# Altium project button.PrjPCB
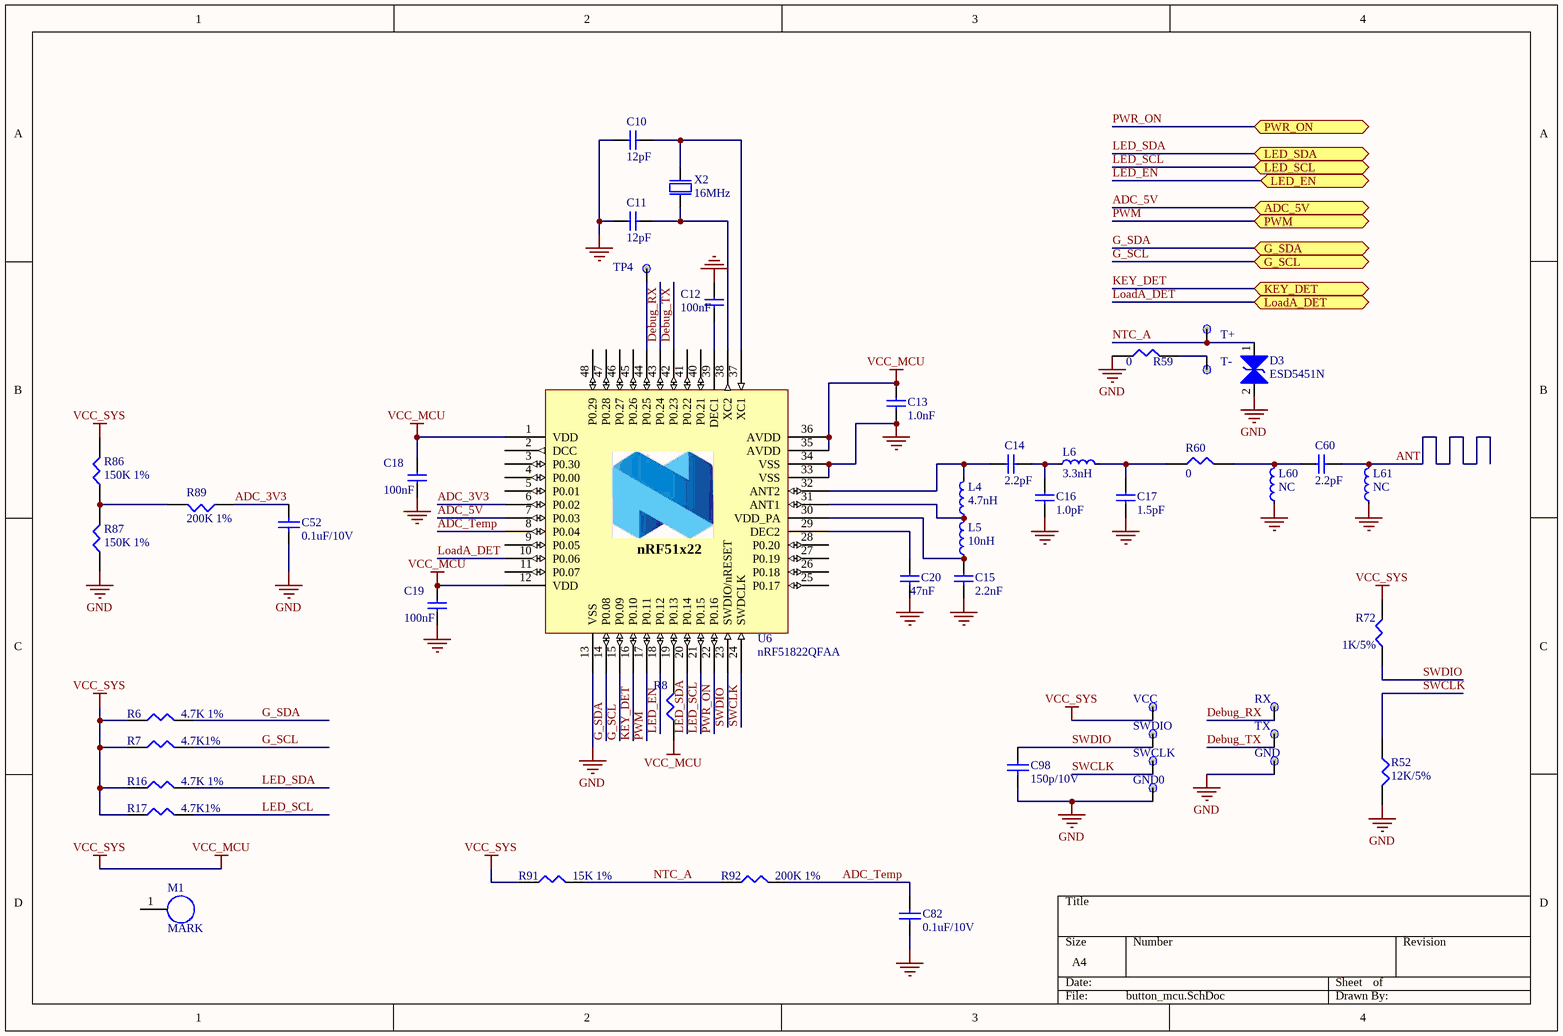
[diagram p0: button_mcu.SchDoc]
3 sheets, 92 parts. Net scope: flat (ports and power ports of the same name join across sheets).
Board files: button_TEST.PcbDoc, button_PVT_P5_201800706.PcbDoc
Sheets:
  button_mcu.SchDoc
  button_peripheral.SchDoc
  LED.SchDoc

## Sheet button_mcu.SchDoc
size A4

### Parts
C10  12pF  [CAPC1005X04L]
C11  12pF  [CAPC1005X04L]
C12  100nF  [CAPC1005X04L]
C13  1.0nF  [CAPC1005X04L]
C14  2.2pF  [CAPC1005X04L]
C15  2.2nF  [CAPC1005X04L]
C16  1.0pF  [CAPC1005X04L]
C17  1.5pF  [CAPC1005X04L]
C18  100nF  [CAPC1005X04L]
C19  100nF  [CAPC1005X04L]
C20  47nF  [CAPC1005X04L]
C52  0.1uF/10V  [0402C]
C60  2.2pF  [0402C]
C82  0.1uF/10V  [0402C]
C98  150p/10V  [0402C]
D3  ESD5451N  [DFN1006-2L]
GND  TP  [TESTPOINT2]  (value not drawn)
GND0  TP  [TESTPOINT2]  (value not drawn)
L4  4.7nH  [INDC1005X04L]
L5  10nH  [INDC1005X04L]
L6  3.3nH  [INDC1005X04L]
L60  NC  [0402R]
L61  NC  [0402R]
M1  MARK  [Mark Point]
R6  4.7K 1%  [0402R]
R7  4.7K1%  [0402R]
R8  1K 5%  [0402R]  (value not drawn)
R16  4.7K 1%  [0402R]
R17  4.7K1%  [0402R]
R52  12K/5%  [0402R]
R59  0  [0402R]
R60  0  [0402R]
R72  1K/5%  [0402R]
R86  150K 1%  [0402R]
R87  150K 1%  [0402R]
R89  200K 1%  [0402R]
R91  15K 1%  [0402R]
R92  200K 1%  [0402R]
RX  TP  [TESTPOINT2]  (value not drawn)
SWCLK  TP  [TESTPOINT2]  (value not drawn)
SWDIO  TP  [TESTPOINT2]  (value not drawn)
T+  TP  [TESTPOINT_PAD]  (value not drawn)
T-  TP  [TESTPOINT_PAD]  (value not drawn)
TP4  TP  [TESTPOINT2]  (value not drawn)
TX  TP  [TESTPOINT2]  (value not drawn)
U6  nRF51822QFAA  [QFN40P600X600X90-48N]
VCC  TP  [TESTPOINT2]  (value not drawn)
X2  16MHz  [XTAL/3225]

### Ports
ADC_5V, G_SCL, G_SDA, KEY_DET, LED_EN, LED_SCL, LED_SDA, LoadA_DET, PWM, PWR_ON

### Nets
GND: C10.2 C11.2 C12.1 C13.2 C15.2 C16.2 C17.2 C18.2 C19.2 C20.2 C52.1 C82.1 C98.1 D3.2 GND.1 GND0.1 L60.1 L61.1 R52.2 R59.1 R87.1 U6.13(VSS) U6.33(VSS) U6.34(VSS) U6.49 X2.2(GND) X2.4(GND)
VCC_MCU: C13.1 C18.1 C19.1 R6.1 R7.1 R8.1 R16.1 R17.1 R72.2 R86.2 R91.1 U6.1(VDD) U6.12(VDD) U6.35(AVDD) U6.36(AVDD) VCC.1  [also labelled VCC_SYS]
ADC_3V3: C52.2 R89.1 U6.6(P0.02)
ADC_5V: U6.7(P0.03) ; port ADC_5V
ADC_Temp: C82.2 R92.2 U6.8(P0.04)
ANT: C60.2 L61.2
Debug_RX: RX.1 U6.43(P0.24)
Debug_TX: TX.1 U6.42(P0.23)
G_SCL: R7.2 U6.15(P0.09) ; port G_SCL
G_SDA: R6.2 U6.14(P0.08) ; port G_SDA
KEY_DET: U6.16(P0.10) ; port KEY_DET
LED_EN: U6.18(P0.12) ; port LED_EN
LED_SCL: R17.2 U6.21(P0.15) ; port LED_SCL
LED_SDA: R16.2 U6.20(P0.14) ; port LED_SDA
LoadA_DET: U6.10(P0.06) ; port LoadA_DET
NTC_A: D3.1 R91.2 R92.1 T+.1
PWM: U6.17(P0.11) ; port PWM
PWR_ON: U6.22(P0.16) ; port PWR_ON
SWCLK: R52.1 SWCLK.1 U6.24(SWDCLK)
SWDIO: C98.2 R72.1 SWDIO.1 U6.23(SWDIO/nRESET)
NetC10_1: C10.1 U6.37(XC1) X2.1(inp)
NetC11_1: C11.1 U6.38(XC2) X2.3(out)
NetC12_2: C12.2 U6.39(DEC1)
NetC14_1: C14.1 L4.2 U6.32(ANT2)
NetC14_2: C14.2 C16.1 L6.1
NetC15_1: C15.1 L5.1 U6.30(VDD_PA)
NetC17_1: C17.1 L6.2 R60.1
NetC20_1: C20.1 U6.29(DEC2)
NetC60_1: C60.1 L60.2 R60.2
NetL4_1: L4.1 L5.2 U6.31(ANT1)
NetR8_2: R8.2 U6.19(P0.13)
NetR59_2: R59.2 T-.1
NetR86_1: R86.1 R87.2 R89.2
NetTP4_1: TP4.1 U6.44(P0.25)

Not connected (* = marked no-connect by the designer): M1 1; U6 2(DCC) 3(P0.30) 4(P0.00) 5(P0.01) 9(P0.05) 11(P0.07) 25(P0.17) 26(P0.18) 27(P0.19) 28(P0.20) 40(P0.21) 41(P0.22) 45(P0.26) 46(P0.27) 47(P0.28) 48(P0.29)

### Notes on the sheet
- (in symbol nRF51x22-QFAC) nRF51x22

### Library data of the parts
C10 C11 = C0402-12p: Capacitor, NP0, ±2%; Note: 50V; Artikkelnr Noca: 20029159; Artikkelnr Simpro: N.A.; Part Number: C0402-12p; Manufacturer: *; Manufacturer Part Number: *; Datasheet: *; LatestRevisionDate: 2011-05-11; Pin Count: 2; Publisher: Nordic Semiconductor; Published: 2009-05-08; Value: 12pF; Supplier: *; Supplier part number: *; 2nd source Supplier: *; 2nd source part number: *; Footprint Doc: 0402
C12 C18 C19 = C0402-100n: Capacitor, X7R, ±10%; Note: 16V; Artikkelnr Noca: 20039200; Artikkelnr Simpro: N.A.; Part Number: C0402-100n; Manufacturer: *; Manufacturer Part Number: *; Datasheet: *; LatestRevisionDate: 2009-11-23; Pin Count: 2; Publisher: Nordic Semiconductor; Published: 2009-05-08; Value: 100nF; Supplier: *; Supplier part number: *; 2nd source Supplier: *; 2nd source part number: *; Footprint Doc: 0402
C13 = C0402-1n0: Capacitor, X7R, ±10%; Note: 50V; Artikkelnr Noca: 20039223; Artikkelnr Simpro: N.A.; Part Number: C0402-1n0; Manufacturer: *; Manufacturer Part Number: *; Datasheet: *; LatestRevisionDate: 2009-11-23; Pin Count: 2; Publisher: Nordic Semiconductor; Published: 2009-05-08; Value: 1.0nF; Supplier: *; Supplier part number: *; 2nd source Supplier: *; 2nd source part number: *; Footprint Doc: 0402
C14 C60 = C0402-3.9p: Capacitor, NP0, ±0.1pF; Value: 3.9pF; Note: 50V; Artikkelnr Noca: N.A.; Part Number: C0402-3.9p; Manufacturer: *; Manufacturer Part Number: *; Datasheet: *; LatestRevisionDate: 2014-09-17; Pin Count: 2; Publisher: Nordic Semiconductor; Published: 2009-05-08; Supplier: *; Supplier part number: *; 2nd source Supplier: *; 2nd source part number: *; Footprint Doc: 0402; Artikkelnr Simpro: N.A.
C15 = C0402-2n2: Capacitor, X7R, ±10%; Note: 50V; Artikkelnr Noca: 20039221; Artikkelnr Simpro: N.A.; Part Number: C0402-2n2; Manufacturer: *; Manufacturer Part Number: *; Datasheet: *; LatestRevisionDate: 2009-11-23; Pin Count: 2; Publisher: Nordic Semiconductor; Published: 2009-05-08; Value: 2.2nF; Supplier: *; Supplier part number: *; 2nd source Supplier: *; 2nd source part number: *; Footprint Doc: 0402
C16 = C0402-1.0p: Capacitor, NP0, ±0.1pF; Note: 50V; Artikkelnr Noca: 20029140; Artikkelnr Simpro: N.A.; Part Number: C0402-1.0p; Manufacturer: *; Manufacturer Part Number: *; Datasheet: *; LatestRevisionDate: 2009-11-23; Pin Count: 2; Publisher: Nordic Semiconductor; Published: 2009-05-08; Value: 1.0pF; Supplier: *; Supplier part number: *; 2nd source Supplier: *; 2nd source part number: *; Footprint Doc: 0402
C17 = C0402-1.5p: Capacitor, NP0, ±0.1pF; Note: 50V; Artikkelnr Noca: 20029139; Artikkelnr Simpro: N.A.; Part Number: C0402-1.5p; Manufacturer: *; Manufacturer Part Number: *; Datasheet: *; LatestRevisionDate: 2009-11-23; Pin Count: 2; Publisher: Nordic Semiconductor; Published: 2009-05-08; Value: 1.5pF; Supplier: *; Supplier part number: *; 2nd source Supplier: *; 2nd source part number: *; Footprint Doc: 0402
C20 = C0402-47n: Capacitor, X7R, ±10%; Note: Chip Cap 10%; Artikkelnr Noca: 20039389; Artikkelnr Simpro: N.A.; Part Number: C0402-47n; Manufacturer: *; Manufacturer Part Number: *; Datasheet: *; LatestRevisionDate: 2009-05-08; Pin Count: 2; Publisher: Nordic Semiconductor; Published: 2009-05-08; Value: 47nF; Supplier: *; Supplier part number: *; 2nd source Supplier: *; 2nd source part number: *; Footprint Doc: 0402
C52 C82 C98 = CAP: Capacitor; Value: 100pF; Ordered by: Subcon; Published: 8-Jun-2000; Revision: July-2002: Re-released for DXP Platform.; Publisher: Altium Limited
D3 = ESD_1: 厂家：ROHM，型号：VMNZC6.8CST2RA
GND GND0 RX SWCLK SWDIO T+ T- TP4 TX VCC = TP: Ordered by: Subcon
L4 = L0402-4n7: High frequency chip inductor ±5%; Manufacturer: Murata; Manufacturer Part Number: LQP15MN4N7B02D; Artikkelnr Noca: 33029164; Artikkelnr Simpro: N.A.; Part Number: L0402-4n7; Datasheet: http://search.murata.co.jp/Ceramy/image/img/PDF/ENG/L0075S0084LQP15M.pdf; LatestRevisionDate: 2012-09-19; Pin Count: 2; Publisher: Nordic Semiconductor; Published: 2009-05-08; Value: 4.7nH; Note: High frequency chip inductor ±5%; Supplier: Digi-Key; Supplier part number: 490-1132-1-ND; 2nd source Supplier: *; 2nd source part number: *; Footprint Doc: 0402
L5 = L0402-27n: High frequency chip inductor ±5%; Manufacturer: Murata; Manufacturer Part Number: LQP15MN27NG02D; Value: 27nH; Note: High frequency chip inductor ±2%; Artikkelnr Noca: N.A.; Part Number: L0402-27n; Datasheet: http://search.murata.co.jp/Ceramy/image/img/PDF/ENG/L0075S0084LQP15M.pdf; LatestRevisionDate: 2014-09-17; Pin Count: 2; Publisher: Nordic Semiconductor; Published: 2014-06-12; Supplier: Digi-Key; Supplier part number: 490-6751-1-ND; 2nd source Supplier: *; 2nd source part number: *; Footprint Doc: 0402; Artikkelnr Simpro: N.A.
L6 = L0402-3n3: High frequency chip inductor ±5%; Manufacturer: Murata; Manufacturer Part Number: LQP15MN3N3B02D; Artikkelnr Noca: 33029369; Artikkelnr Simpro: N.A.; Part Number: L0402-3n3; Datasheet: http://search.murata.co.jp/Ceramy/image/img/PDF/ENG/L0075S0084LQP15M.pdf; LatestRevisionDate: 2012-09-19; Pin Count: 2; Publisher: Nordic Semiconductor; Published: 2009-05-08; Value: 3.3nH; Note: High frequency chip inductor ±5%; Supplier: Digi-Key; Supplier part number: 490-1130-1-ND; 2nd source Supplier: *; 2nd source part number: *; Footprint Doc: 0402
L60 L61 = L0402-4n7: High frequency chip inductor ±5%; Manufacturer: Murata; Manufacturer Part Number: LQP15MN4N7B02D; Value: 4.7nH; Artikkelnr Noca: 33029164; Artikkelnr Simpro: N.A.; Part Number: L0402-4n7; Datasheet: http://search.murata.co.jp/Ceramy/image/img/PDF/ENG/L0075S0084LQP15M.pdf; LatestRevisionDate: 2012-09-19; Pin Count: 2; Publisher: Nordic Semiconductor; Published: 2009-05-08; Note: High frequency chip inductor ±5%; Supplier: Digi-Key; Supplier part number: 490-1132-1-ND; 2nd source Supplier: *; 2nd source part number: *; Footprint Doc: 0402
M1 = PAD1: None
R6-R8 R16 R17 R52 R59 R60 R72 R86 R87 R89 R91 R92 = RES1: 厂家：Yageo，型号：RC0402FR-0720RL
U6 = nRF51x22-QFAC: Multi-protocol Bluetooth Low Energy, ANT and 2.4GHz proprietary system-on-chip; Manufacturer: Nordic Semiconductor; Note: nRF51422 - QFN48 6x6 0.4mm pitch; Artikkelnr Noca: N.A.; Part Number: nRF51x22-QFAC; Manufacturer Part Number: nRF51x22-QFAC; Datasheet: *; LatestRevisionDate: 2014-09-24; Pin Count: 48; Publisher: Nordic Semiconductor; Published: 2014-09-24; Value: nRF51x22-QFAC; Supplier: Nordic Semiconductor; Supplier part number: *; 2nd source Supplier: *; 2nd source part number: *; Footprint Doc: QFN-48; Artikkelnr Simpro: N.A.
X2 = NX2520SA-16MHZ-STD-CSW-5: XTAL SMD 2520, 16MHz, 8pF, ±40ppm; Manufacturer: NDK; Note: XTAL SMD 16.000MHz; Artikkelnr Noca: 22019192; Artikkelnr Simpro: N.A.; Part Number: NX2520SA-16MHZ-STD-CSW-5; Manufacturer Part Number: NX2520SA-16MHZ-STD-CSW-5; Datasheet: http://www.ndk.com/images/products/catalog/c_NX2520SA-STD-CSW-5_e.pdf; LatestRevisionDate: 2012-06-15; Pin Count: 4; Publisher: Nordic Semiconductor; Published: 2012-06-15; Value: 16MHz; Supplier: Digi-Key; Supplier part number: 644-1169-1-ND; 2nd source Supplier: *; 2nd source part number: *; Footprint Doc: BT-XTAL_2520

## Sheet button_peripheral.SchDoc
size A4
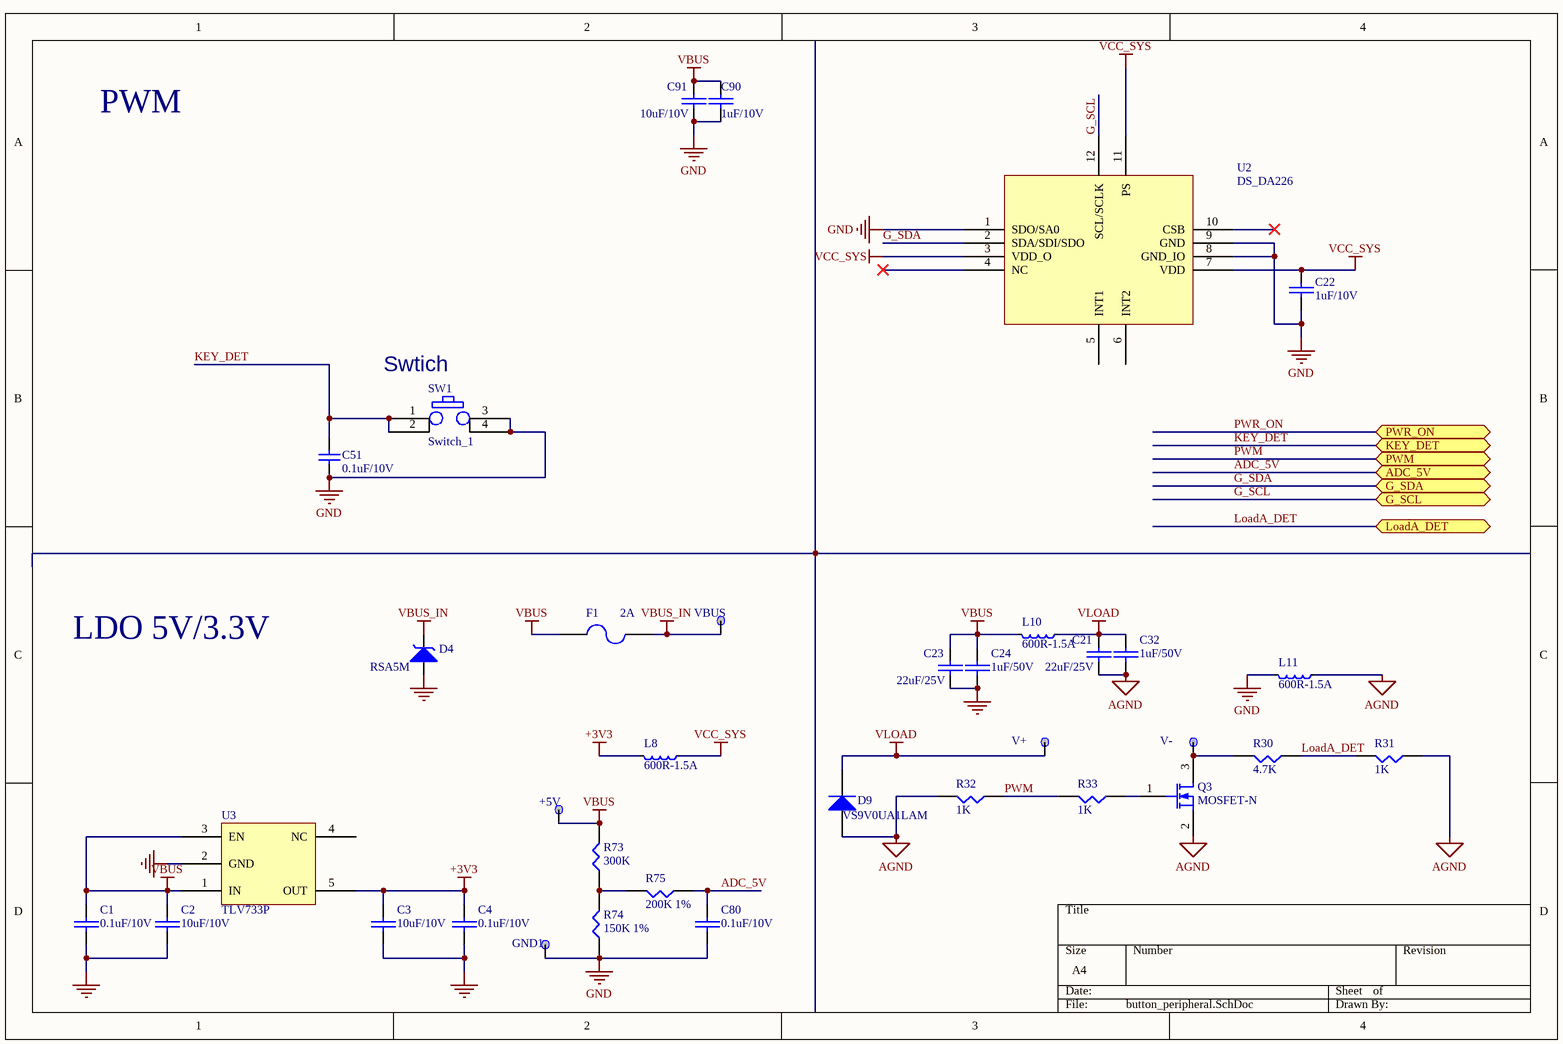
[diagram p1: button_peripheral.SchDoc]

### Parts
+5V  TP  [TESTPOINT2]  (value not drawn)
C1  0.1uF/10V  [0402C]
C2  10uF/10V  [0603C]
C3  10uF/10V  [0603C]
C4  0.1uF/10V  [0402C]
C21  22uF/25V  [0603C]
C22  1uF/10V  [0402C]
C23  22uF/25V  [0603C]
C24  1uF/50V  [0402C]
C32  1uF/50V  [0402C]
C51  0.1uF/10V  [0402C]
C80  0.1uF/10V  [0402C]
C90  1uF/10V  [0402C]
C91  10uF/10V  [TAN_0603]
D4  RSA5M  [SOD-123]
D9  VS9V0UA1LAM  [SOD_128]
F1  2A  [1206-FUSE - duplicate]
GND1  TP  [TESTPOINT_PAD]  (value not drawn)
L8  600R-1.5A  [L_0603]
L10  600R-1.5A  [L_0603]
L11  600R-1.5A  [L_0603]
Q3  MOSFET-N  [TSMT3]
R30  4.7K  [0402R]
R31  1K  [0402R]
R32  1K  [0402R]
R33  1K  [0402R]
R73  300K  [0402R]
R74  150K 1%  [0402R]
R75  200K 1%  [0402R]
SW1  Switch_1  [KEY_Panasonic]
U2  DS_DA226  [LGA-12]
U3  TLV733P  [SOT-23-5]
V+  TP  [TESTPOINT_PAD]  (value not drawn)
V-  TP  [TESTPOINT_PAD]  (value not drawn)
VBUS  TP  [TESTPOINT_PAD]  (value not drawn)

### Ports
ADC_5V, G_SCL, G_SDA, KEY_DET, LoadA_DET, PWM, PWR_ON

### Nets
+3V3: C3.1 C4.1 L8.2 U3.5(OUT)
AGND: C21.2 C32.2 D9.2(A) L11.1 Q3.2(S) R31.1 R32.2
GND: C1.2 C2.2 C3.2 C4.2 C22.2 C23.2 C24.2 C51.1 C80.2 C90.2 C91.2 D4.2(dIode2) GND1.1 L11.2 R74.1 SW1.3 SW1.4 U2.1(SDO/SA0) U2.8(GND_IO) U2.9(GND) U3.2(GND)
VBUS: +5V.1 C1.1 C2.1 C23.1 C24.1 C90.1 C91.1 F1.1 L10.2 R73.2 U3.1(IN) U3.3(EN)
VBUS_IN: D4.1(Diode1) F1.2 VBUS.1
VCC_SYS: C22.1 L8.1 U2.3(VDD_O) U2.7(VDD) U2.11(PS)  [project net VCC_MCU]
VLOAD: C21.1 C32.1 D9.1(K) L10.1 V+.1
ADC_5V: C80.1 R75.1 ; port ADC_5V
G_SCL: U2.12(SCL/SCLK) ; port G_SCL
G_SDA: U2.2(SDA/SDI/SDO) ; port G_SDA
KEY_DET: C51.2 SW1.1 SW1.2 ; port KEY_DET
LoadA_DET: R30.1 R31.2 ; port LoadA_DET
PWM: R32.1 R33.2 ; port PWM
NetQ3_1: Q3.1(G) R33.1
NetQ3_3: Q3.3(D) R30.2 V-.1
NetR73_1: R73.1 R74.2 R75.2

Not connected (* = marked no-connect by the designer): U2 4(NC)* 5(INT1) 6(INT2) 10(CSB)*; U3 4(NC)

### Notes on the sheet
- PWM
- (near SW1) Swtich
- LDO 5V/3.3V

### Library data of the parts
+5V GND1 V+ V- VBUS = TP: Ordered by: Subcon
C1 C4 C22 C24 C32 C80 = CAP: 厂家：Murata，型号：GRM155R71A104KA01D
C2 C3 C21 C23 C90 C91 = CAP: 厂家：Murata，型号：GRM188R61A106KE69D
C51 = CAP: as C52 on sheet button_mcu; Published: 8-Jun-2000; Revision: July-2002: Re-released for DXP Platform.; Publisher: Altium Limited
D4 = ESD_1: 厂家：ROHM，型号：VMNZC6.8CST2RA
D9 = Diode 1N4148: High Conductance Fast Diode
F1 = FUSE2: 厂家：万瑞和，型号：smd1206-200
L8 L10 L11 = L0402-27n: as L5 on sheet button_mcu; Part Number: L0402-27n; Datasheet: http://search.murata.co.jp/Ceramy/image/img/PDF/ENG/L0075S0084LQP15M.pdf; LatestRevisionDate: 2014-09-17; Pin Count: 2; Publisher: Nordic Semiconductor; Published: 2014-06-12; Supplier: Digi-Key; Supplier part number: 490-6751-1-ND; 2nd source Supplier: *; 2nd source part number: *; Footprint Doc: 0402; Artikkelnr Simpro: N.A.
Q3 = MOSFET: N-Channel MOSFET; Published: 8-Jun-2000; LatestRevisionDate: 17-Jul-2002; LatestRevisionNote: Re-released for DXP Platform.; PackageVersion: 1995/1996; PackageReference: E3; Publisher: Altium Limited; PackageDescription: TO, Flat Index; 3 In-Line, Axial Leads; Body Dia. 4.6mm; Lead Dia. 0.5 mm (max)
R30-R33 R73-R75 = RES1: 厂家：Yageo，型号：RC0402FR-0720RL
SW1 = Switch_1: 厂家：松下，型号：EVQPLMA15
U2 = LIS2DE12: 厂家：ST，型号：LIS2DH12
U3 = AP3410

## Sheet LED.SchDoc
size A4
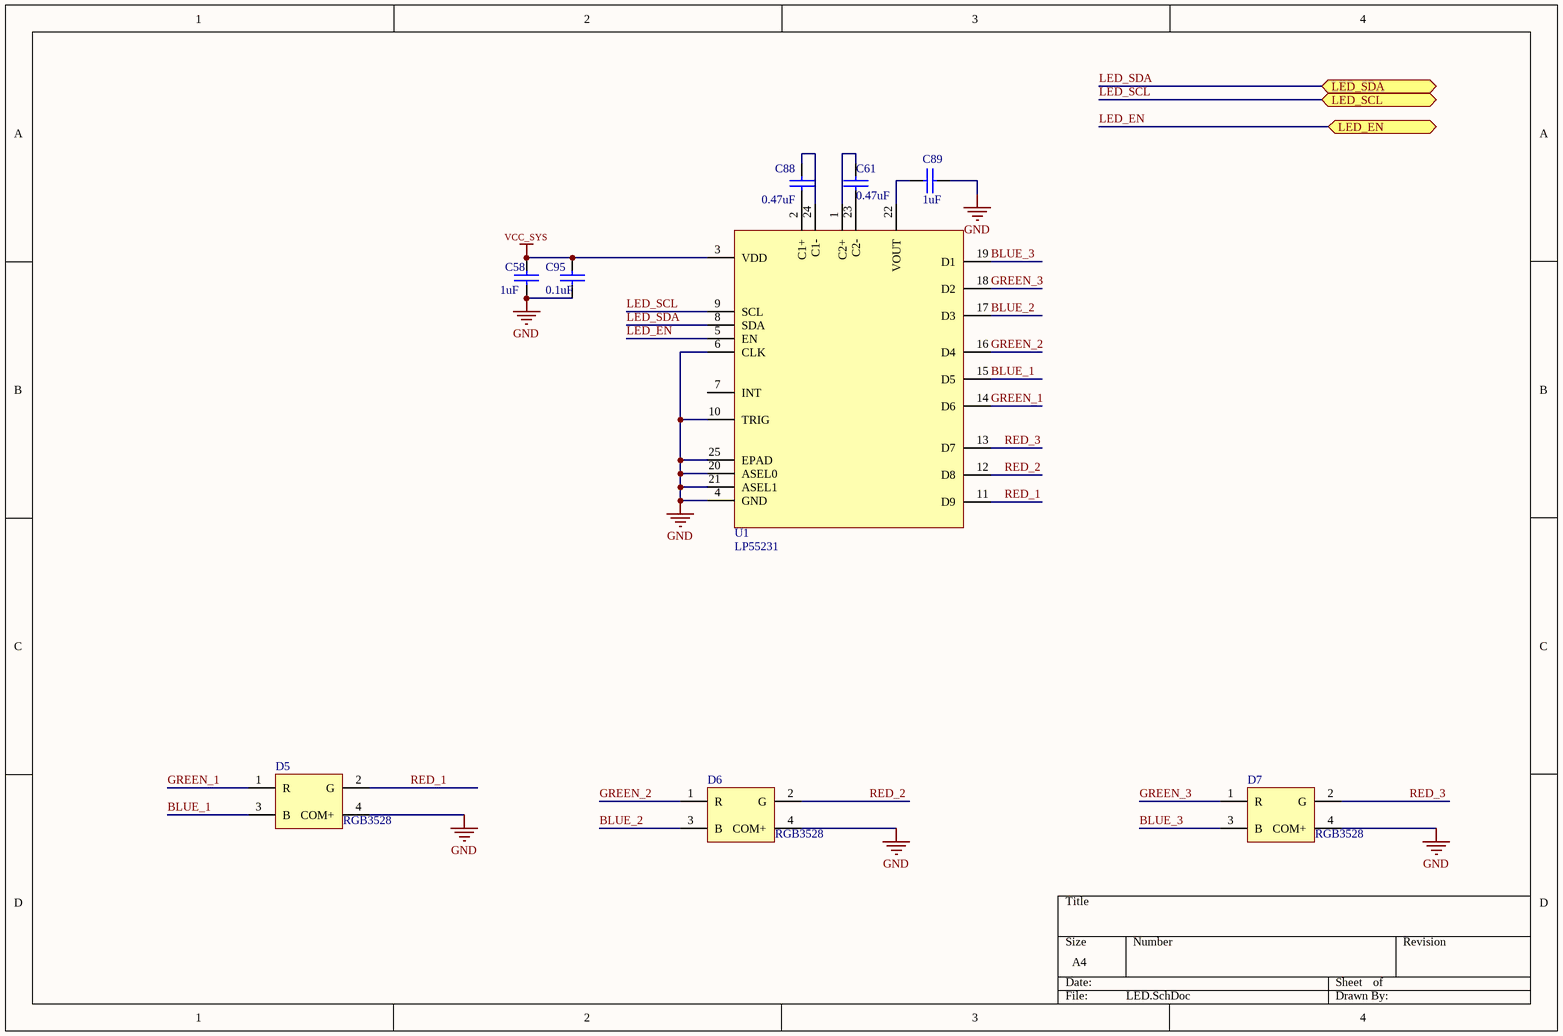
[diagram p2: LED.SchDoc]

### Parts
C58  1uF  [0402C]
C61  0.47uF  [0402C]
C88  0.47uF  [0402C]
C89  1uF  [0402C]
C95  0.1uF  [0402C]
D5  RGB3528  [19-237B/R6GHBHC-C01/2T]
D6  RGB3528  [19-237B/R6GHBHC-C01/2T]
D7  RGB3528  [19-237B/R6GHBHC-C01/2T]
U1  LP55231  [WQFN24]

### Ports
LED_EN, LED_SCL, LED_SDA

### Nets
GND: C58.2 C89.1 C95.2 D5.4(COM+) D6.4(COM+) D7.4(COM+) U1.4(GND) U1.6(CLK) U1.10(TRIG) U1.20(ASEL0) U1.21(ASEL1) U1.25(EPAD)
VCC_SYS: C58.1 C95.1 U1.3(VDD)  [project net VCC_MCU]
BLUE_1: D5.3(B) U1.15(D5)
BLUE_2: D6.3(B) U1.17(D3)
BLUE_3: D7.3(B) U1.19(D1)
GREEN_1: D5.1(R) U1.14(D6)
GREEN_2: D6.1(R) U1.16(D4)
GREEN_3: D7.1(R) U1.18(D2)
LED_EN: U1.5(EN) ; port LED_EN
LED_SCL: U1.9(SCL) ; port LED_SCL
LED_SDA: U1.8(SDA) ; port LED_SDA
RED_1: D5.2(G) U1.11(D9)
RED_2: D6.2(G) U1.12(D8)
RED_3: D7.2(G) U1.13(D7)
NetC61_1: C61.1 U1.1(C2+)
NetC61_2: C61.2 U1.23(C2-)
NetC88_1: C88.1 U1.2(C1+)
NetC88_2: C88.2 U1.24(C1-)
NetC89_2: C89.2 U1.22(VOUT)

Not connected (* = marked no-connect by the designer): U1 7(INT)

### Library data of the parts
C58 = CAP: 1uF/10V/X7R/10%，0402
C61 C95 = CAP: 0.1uF/10V/X7R/10%，0402
C88 C89 = CAP: 0.22uF/10V/X7R/10%，0402
U1 = SN3199: 厂家：SI-EN，型号：IS31FL3199-QFLS2-TR
D5-D7 = RGB3528: Published: 24-Mar-1999; LatestRevisionDate: 17-Jul-2002; LatestRevisionNote: Re-released for DXP Platform.; PackageReference: D-46_6A; Publisher: Altium Limited; PackageDescription: Bridge Rectifier; 4 Terminals; Body 16.8 x 16.8 mm (typ); Pitch 10.67 mm

## Nets that join several sheets
GND: button_mcu (27 pins), button_peripheral (21 pins), LED (12 pins)
VCC_MCU: button_mcu (16 pins), button_peripheral (5 pins), LED (C58.1 C95.1 U1.3)
ADC_5V: button_mcu (U6.7), button_peripheral (C80.1 R75.1)
G_SCL: button_mcu (R7.2 U6.15), button_peripheral (U2.12)
G_SDA: button_mcu (R6.2 U6.14), button_peripheral (U2.2)
KEY_DET: button_mcu (U6.16), button_peripheral (C51.2 SW1.1 SW1.2)
LED_EN: button_mcu (U6.18), LED (U1.5)
LED_SCL: button_mcu (R17.2 U6.21), LED (U1.9)
LED_SDA: button_mcu (R16.2 U6.20), LED (U1.8)
LoadA_DET: button_mcu (U6.10), button_peripheral (R30.1 R31.2)
PWM: button_mcu (U6.17), button_peripheral (R32.1 R33.2)